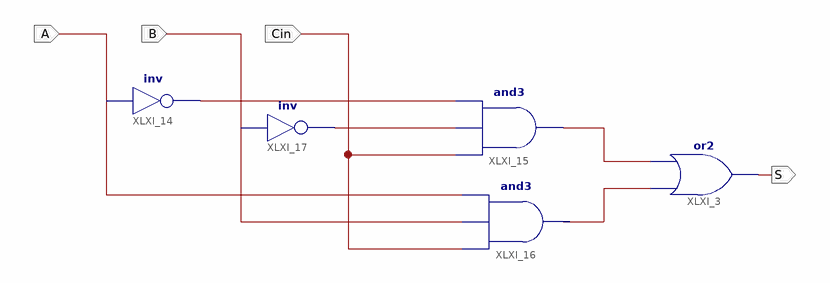
[diagram p0: schematic sheet 1]
// Xilinx ISE schematic Equals.sch (xa9500xl) as structural Verilog: 5 symbols, 4 ports
module Equals (
  input  A,
  input  B,
  input  Cin,
  output S
);

  wire XLXN_1, XLXN_2, XLXN_22, XLXN_23;

  or XLXI_3 (S, XLXN_2, XLXN_1);
  not XLXI_14 (XLXN_22, A);
  and XLXI_15 (XLXN_1, Cin, XLXN_23, XLXN_22);
  and XLXI_16 (XLXN_2, Cin, B, A);
  not XLXI_17 (XLXN_23, B);
endmodule
